# EAGLE schematic MainBoard (EAGLE 9.1.0)
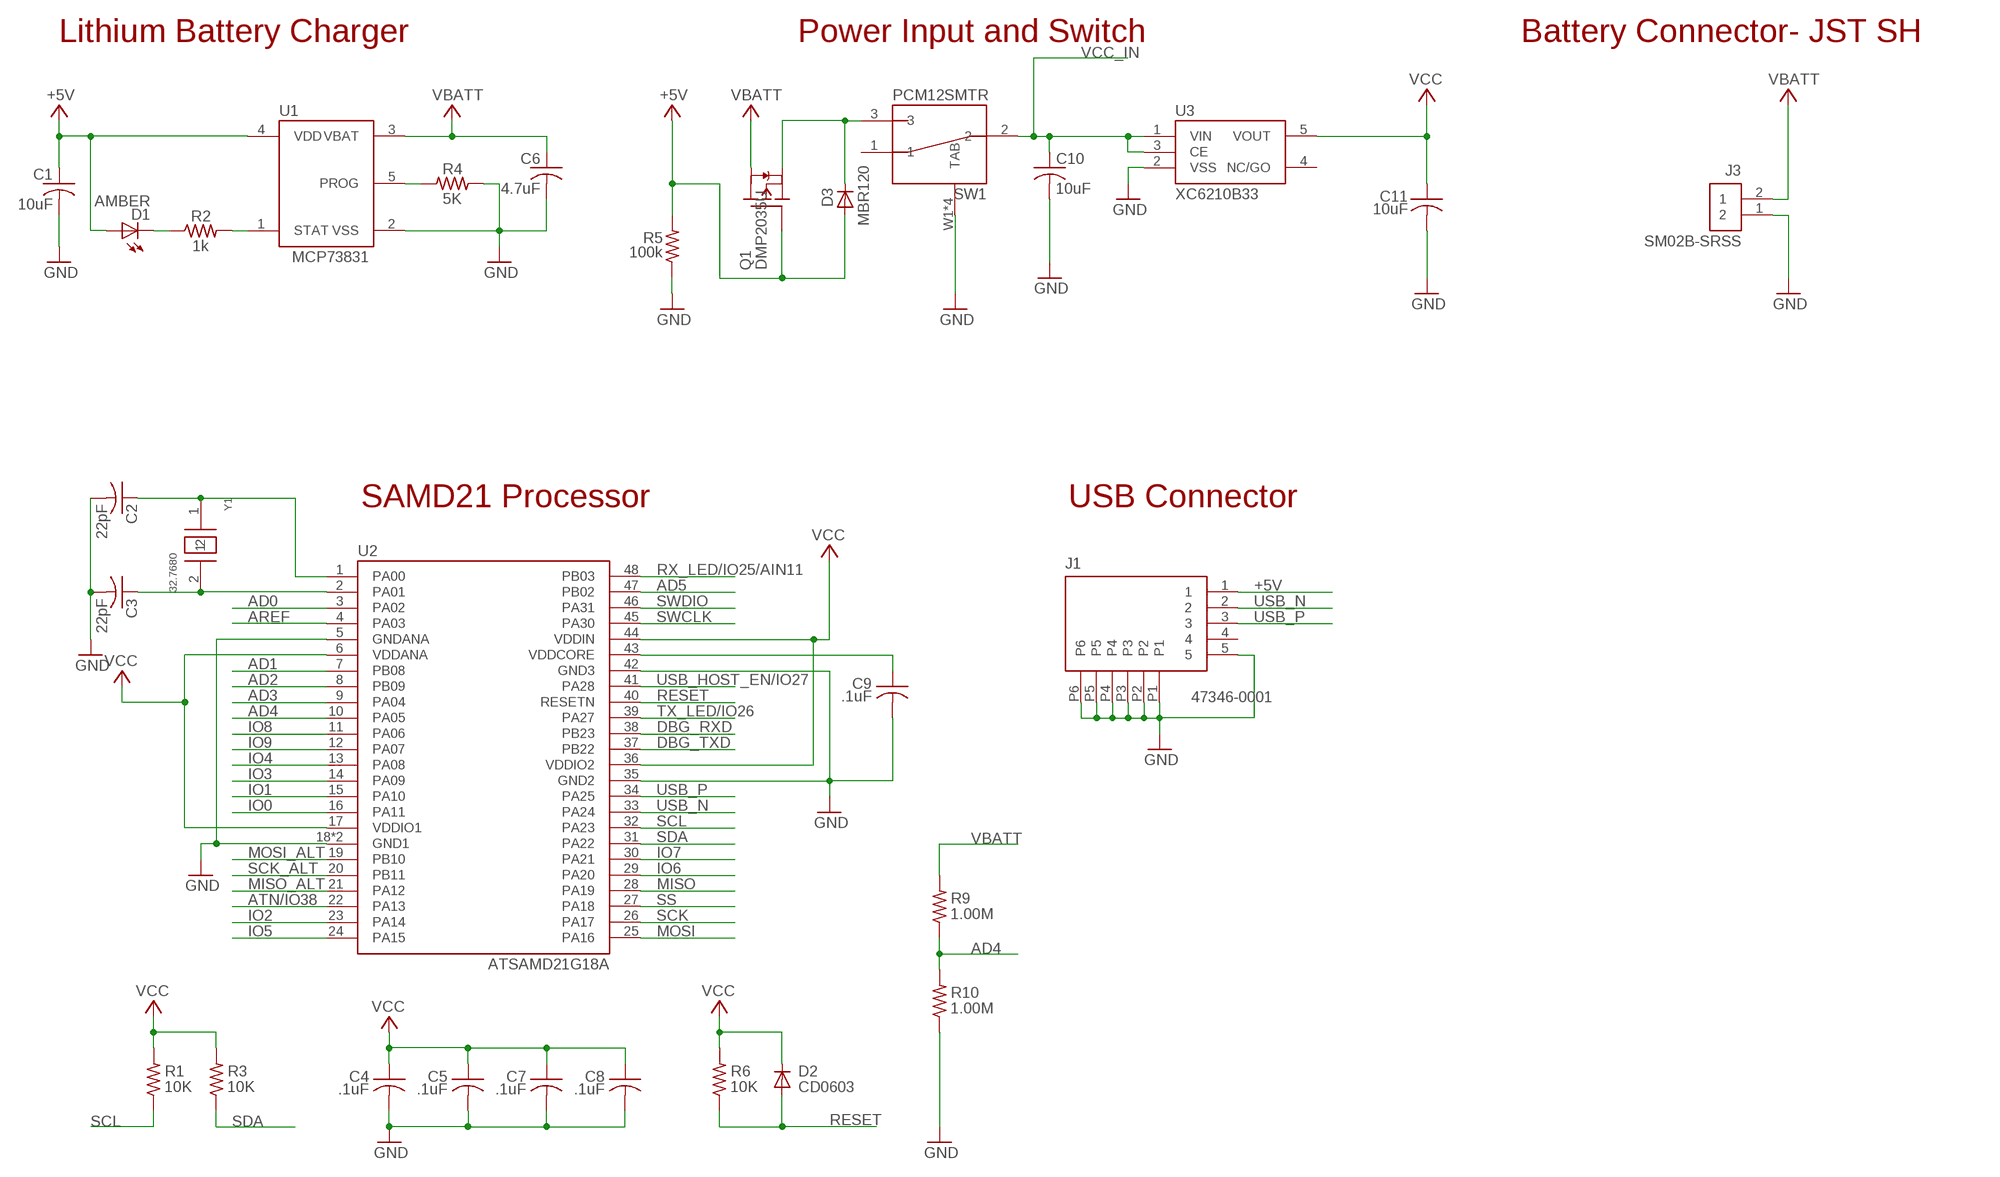
[diagram p0: schematic, sheet 1]

## Parts
C1  10uF  AS-ITM-00002  [C0603]
C2  22pF  AS-ITM-00211  [C0402]
C3  22pF  AS-ITM-00211  [C0402]
C4  .1uF  AS-ITM-00008  [C0402]
C5  .1uF  AS-ITM-00008  [C0402]
C6  4.7uF  AS-ITM-00088  [C0603]
C7  .1uF  AS-ITM-00008  [C0402]
C8  .1uF  AS-ITM-00008  [C0402]
C9  .1uF  AS-ITM-00008  [C0402]
C10  10uF  AS-ITM-00045  [C0805]
C11  10uF  AS-ITM-00002  [C0603]
D1  AMBER  AS-ITM-00026  [LNJ_LED]
D2  CD0603  AS-ITM-00009  [0603]
D3  MBR120  AS-ITM-00111  [SOD-123FL]
J1  47346-0001  AS-ITM-00021  [MICRO_USB]
J3  SM02B-SRSS  AS-ITM-00231  [JST_SH_2X1]
Q1  DMP2035U  AS-ITM-00024  [SOT23]
R1  10K  AS-ITM-00032  [0402]
R2  1k  AS-ITM-00003  [0402]
R3  10K  AS-ITM-00032  [0402]
R4  5K  AS-ITM-00289  [0402]
R5  100k  AS-ITM-00004  [0402]
R6  10K  AS-ITM-00032  [0402]
R9  1.00M  AS-ITM-00005  [0402]
R10  1.00M  AS-ITM-00005  [0402]
SW1  PCM12SMTR  AS-ITM-00220  [PCM12SMTR]
U1  MCP73831  AS-ITM-00136  [SOT-23]
U2  ATSAMD21G18A  AS-ITM-00273  [QFN48]
U3  XC6210B33  AS-ITM-00046  [SOT-25]
Y1  32.7680  AS-ITM-00279  [ABS06]

## Nets
+5V: C1.1 D1.A D3.A J1.1 Q1.B(G) R5.2 U1.4(VDD)
AD0: U2.3(PA02)
AD1: U2.7(PB08)
AD2: U2.8(PB09)
AD3: U2.9(PA04)
AD4: R9.1 R10.2 U2.10(PA05)
AD5: U2.47(PB02)
AREF: U2.4(PA03)
ATN/IO38: U2.22(PA13)
DBG_RXD: U2.38(PB23)
DBG_TXD: U2.37(PB22)
GND: C1.2 C2.2 C3.2 C4.2 C5.2 C6.2 C7.2 C8.2 C9.2 C10.2 C11.2 J1.5 J1.P1 J1.P2 J1.P3 J1.P4 J1.P5 J1.P6 J3.1 R4.2 R5.1 R10.1 SW1.W1(TAB) SW1.W2(TAB) SW1.W3(TAB) SW1.W4(TAB) U1.2(VSS) U2.5(GNDANA) U2.18(GND1) U2.35(GND2) U2.42(GND3) U2.EXP(GND1) U3.2(VSS)
IO0: U2.16(PA11)
IO1: U2.15(PA10)
IO2: U2.23(PA14)
IO3: U2.14(PA09)
IO4: U2.13(PA08)
IO5: U2.24(PA15)
IO6: U2.29(PA20)
IO7: U2.30(PA21)
IO8: U2.11(PA06)
IO9: U2.12(PA07)
MISO: U2.28(PA19)
MISO_ALT: U2.21(PA12)
MOSI: U2.25(PA16)
MOSI_ALT: U2.19(PB10)
N$1: C2.1 U2.1(PA00) Y1.1
N$2: D3.C Q1.E(S) SW1.3
N$3: C3.1 U2.2(PA01) Y1.2
N$5: D1.C R2.1
N$6: R4.1 U1.5(PROG)
N$7: R2.2 U1.1(STAT)
N$8: C9.1 U2.43(VDDCORE)
RESET: D2.A R6.1 U2.40(RESETN)
RX_LED/IO25/AIN11: U2.48(PB03)
SCK: U2.26(PA17)
SCK_ALT: U2.20(PB11)
SCL: R1.1 U2.32(PA23)
SDA: R3.1 U2.31(PA22)
SS: U2.27(PA18)
SWCLK: U2.45(PA30)
SWDIO: U2.46(PA31)
TX_LED/IO26: U2.39(PA27)
USB_HOST_EN/IO27: U2.41(PA28)
USB_N: J1.2 U2.33(PA24)
USB_P: J1.3 U2.34(PA25)
VBATT: C6.1 J3.2 Q1.C(D) R9.2 U1.3(VBAT)
VCC: C4.1 C5.1 C7.1 C8.1 C11.1 D2.C R1.2 R3.2 R6.2 U2.6(VDDANA) U2.17(VDDIO1) U2.36(VDDIO2) U2.44(VDDIN) U3.5(VOUT)
VCC_IN: C10.1 SW1.2 U3.1(VIN) U3.3(CE)
Unconnected: J1.4 SW1.1 U3.4(NC/GO)

## Notes on the sheet
- Lithium Battery Charger | Power Input and Switch | Battery Connector- JST SH
- SAMD21 Processor | USB Connector

## Library data of the parts
C1 C11 = tinycircuits:AS-ITM-00002: CAP CER 10UF 10V 20% X5R 0603; PARTNO: AS-ITM-00002
C2 C3 = tinycircuits:AS-ITM-00211: CAP CER 22PF 50V 2% NP0 0402; PARTNO: AS-ITM-00211
C4 C5 C7-C9 = tinycircuits:AS-ITM-00008: CAP CER 0.1UF 16V 10% X5R 0402; PARTNO: AS-ITM-00008; VALUE: 0.1uF
C6 = tinycircuits:AS-ITM-00088: CAP CER 4.7UF 6.3V 20% X5R 0603; PARTNO: AS-ITM-00088
C10 = tinycircuits:AS-ITM-00045: CAP CER 16UF 16V 20% X5R 0805; PARTNO: AS-ITM-00045
D1 = tinycircuits:AS-ITM-00026: LED AMBER SIDE VIEW SMD; PARTNO: AS-ITM-00026; PNPROTATION: 90
D2 = tinycircuits:AS-ITM-00009: Diodes (General Purpose, Power, Switching) IO=150mA VR=75V HIGH SPEED; PARTNO: AS-ITM-00009
D3 = tinycircuits:AS-ITM-00111: DIODE SCHOTTKY 20V 1A SOD123L; PARTNO: AS-ITM-00111; VALUE: MBR120VLSFT1G
J1 = tinycircuits:AS-ITM-00021: CONN RCPT 5POS MICRO USB R/A; PARTNO: AS-ITM-00021; PNPROTATION: 90
J3 = tinycircuits:AS-ITM-00231: CONN HEADER SH 2POS SIDE 1MM; PARTNO: AS-ITM-00231; PNPROTATION: 180; VALUE: SM02B-SRSS-TB(LF)(SN)
Q1 = tinycircuits:AS-ITM-00024: P-Channel MOSFET SOT-23; PARTNO: AS-ITM-00024; PNPROTATION: 0
R1 R3 R6 = tinycircuits:AS-ITM-00032: RES 10.0K OHM 1/16W 1% 0402 SMD; PARTNO: AS-ITM-00032; VALUE: 10.0K
R2 = tinycircuits:AS-ITM-00003: RES 1.00K OHM 1/16W 1% 0402; PARTNO: AS-ITM-00003; VALUE: 1.00K
R4 = tinycircuits:AS-ITM-00289: RES SMD 5.0K OHM 1% 1/16W 0402; PARTNO: AS-ITM-00289
R5 = tinycircuits:AS-ITM-00004: RES 100K OHM 1/16W 1% 0402; PARTNO: AS-ITM-00004; VALUE: 100K
R9 R10 = tinycircuits:AS-ITM-00005: RES 1.00M OHM 1/16W 1% 0402; PARTNO: AS-ITM-00005
SW1 = tinycircuits:AS-ITM-00220: SW SLIDE SP2T 6VDC 0.3A SMT; PARTNO: AS-ITM-00220; PNPROTATION: 0
U1 = tinycircuits:AS-ITM-00136: IC CONTROLLER LI-ION 4.2V SOT23-5; PARTNO: AS-ITM-00136; PNPROTATION: 270
U2 = tinycircuits:AS-ITM-00273: IC MCU 32BIT 256KB FLASH 48QFN; PARTNO: AS-ITM-00273; PNPROTATION: 270
U3 = tinycircuits:AS-ITM-00046: IC REG LDO 3.3V .7A SOT-25; PARTNO: AS-ITM-00046; PNPROTATION: 270
Y1 = tinycircuits:AS-ITM-00279: Crystal 32.7680kHz 20ppm 12.5pF; PARTNO: AS-ITM-00279